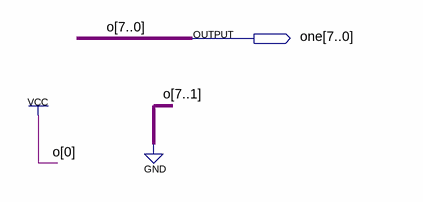
[diagram p0: schematic sheet]
// Quartus schematic one.bdf as structural Verilog: 0 symbols, 1 pins
module one (
  output [7:0] one
);


  assign one = 8'b00000001;
endmodule
